# EAGLE schematic TZATZIKI_v3 (EAGLE 7.6.0)
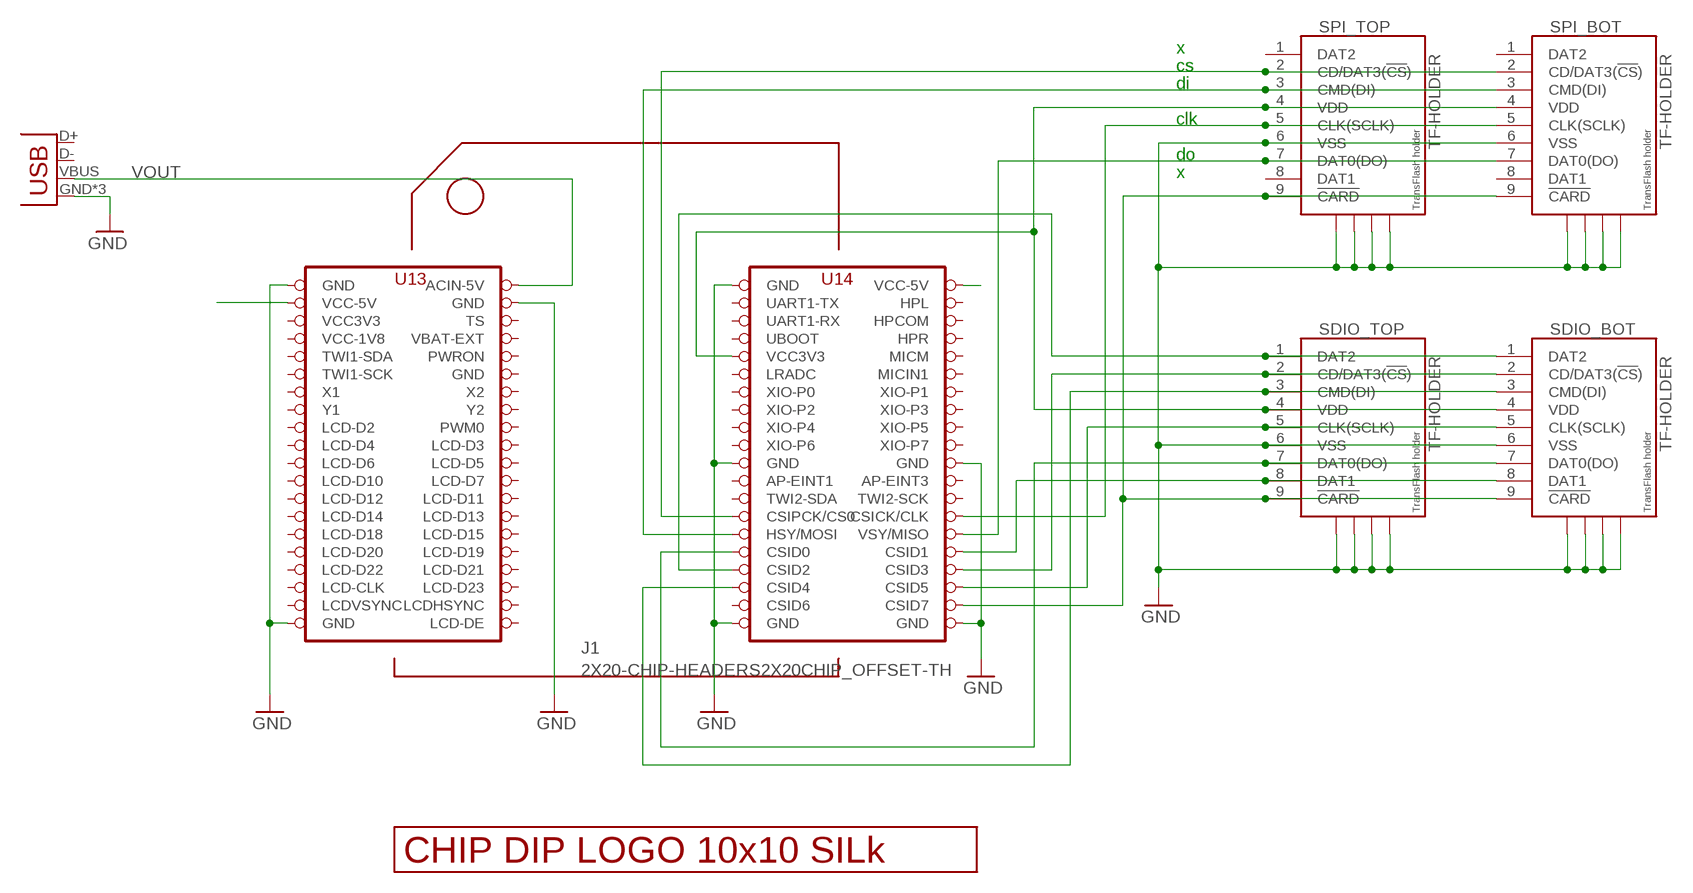
[diagram p0: schematic, sheet 1]

## Parts
J1  2X20-CHIP-HEADERS2X20CHIP_OFFSET-TH  [2X20CHIP_OFFSET-TH]
POWER_USB  USBUSB-MICROB-SMT-DIP  [USB-MICROB-SMT-DIP]
SDIO_BOT  TF-HOLDER  [TF-PULL]
SDIO_TOP  TF-HOLDER  [TF-PULL]
SPI_BOT  TF-HOLDER  [TF-PULL]
SPI_TOP  TF-HOLDER  [TF-PULL]
U$1  LOGO_10X10_SILK  [LOGO_10X10_SILK]

## Nets
GND: J1.GND@1(GND) J1.GND@2(GND) J1.GND@4(GND) J1.GND@5(GND) J1.GND@6(GND) J1.GND@7(GND) J1.GND@8(GND) J1.GND@10(GND) POWER_USB.GND POWER_USB.MT1(GND) POWER_USB.MT2(GND) SDIO_BOT.6(VSS) SDIO_BOT.S1 SDIO_BOT.S2 SDIO_BOT.S3 SDIO_BOT.S4 SDIO_TOP.6(VSS) SDIO_TOP.S1 SDIO_TOP.S2 SDIO_TOP.S3 SDIO_TOP.S4 SPI_BOT.6(VSS) SPI_BOT.S1 SPI_BOT.S2 SPI_BOT.S3 SPI_BOT.S4 SPI_TOP.6(VSS) SPI_TOP.S1 SPI_TOP.S2 SPI_TOP.S3 SPI_TOP.S4
N$2: J1.CSID3 SDIO_BOT.2(CD/DAT3(!CS!)) SDIO_TOP.2(CD/DAT3(!CS!))
N$3: J1.CSID0 SDIO_BOT.7(DAT0(DO)) SDIO_TOP.7(DAT0(DO))
N$4: J1.CSID4 SDIO_BOT.3(CMD(DI)) SDIO_TOP.3(CMD(DI))
N$5: J1.CSID5 SDIO_BOT.5(CLK(SCLK)) SDIO_TOP.5(CLK(SCLK))
N$6: J1.CSID1 SDIO_BOT.8(DAT1) SDIO_TOP.8(DAT1)
N$7: J1.VCC5V@1(VCC-5V)
N$8: J1.VCC5V@0(VCC-5V)
N$9: J1.CSID2 SDIO_BOT.1(DAT2) SDIO_TOP.1(DAT2)
N$10: J1.VCC3V3@1(VCC3V3) SDIO_BOT.4(VDD) SDIO_TOP.4(VDD) SPI_BOT.4(VDD) SPI_TOP.4(VDD)
N$11: J1.CSIPCK(CSIPCK/CS0) SPI_BOT.2(CD/DAT3(!CS!)) SPI_TOP.2(CD/DAT3(!CS!))
N$12: J1.CSIHSYNC(HSY/MOSI) SPI_BOT.3(CMD(DI)) SPI_TOP.3(CMD(DI))
N$13: J1.CSIVSYNC(VSY/MISO) SPI_BOT.7(DAT0(DO)) SPI_TOP.7(DAT0(DO))
N$14: J1.CSICK(CSICK/CLK) SPI_BOT.5(CLK(SCLK)) SPI_TOP.5(CLK(SCLK))
N$16: J1.CSID7 SDIO_BOT.9(!CARD) SDIO_TOP.9(!CARD) SPI_BOT.9(!CARD) SPI_TOP.9(!CARD)
VOUT: J1.CHG-IN(ACIN-5V) POWER_USB.VBUS
Unconnected: J1.AP-EINT1 J1.AP-EINT3 J1.BAT(VBAT-EXT) J1.CSID6 J1.FEL(UBOOT) J1.HPCOM J1.HPL J1.HPR J1.LCD-CLK J1.LCD-D2 J1.LCD-D3 J1.LCD-D4 J1.LCD-D5 J1.LCD-D6 J1.LCD-D7 J1.LCD-D10 J1.LCD-D11 J1.LCD-D12 J1.LCD-D13 J1.LCD-D14 J1.LCD-D15 J1.LCD-D18 J1.LCD-D19 J1.LCD-D20 J1.LCD-D21 J1.LCD-D22 J1.LCD-D23 J1.LCD-DE J1.LCD-HSYNC(LCDHSYNC) J1.LCD-VSYNC(LCDVSYNC) J1.LRADC J1.MICIN1 J1.MICM J1.PWM0 J1.PWRON J1.TS J1.TWI1-SCK J1.TWI1-SDA J1.TWI2-SCK J1.TWI2-SDA J1.UART1-RX J1.UART1-TX J1.X1 J1.X2 J1.XIO-P0 J1.XIO-P1 J1.XIO-P2 J1.XIO-P3 J1.XIO-P4 J1.XIO-P5 J1.XIO-P6 J1.XIO-P7 J1.Y1 J1.Y2 POWER_USB.D+ POWER_USB.D- SPI_BOT.1(DAT2) SPI_BOT.8(DAT1) SPI_TOP.1(DAT2) SPI_TOP.8(DAT1)

## Notes on the sheet
- x
- cs
- di
- clk
- do
- x

## Power pins joined to a net without a drawn wire
GND: J1.GND@3(GND)
VCC3V3: J1.VCC3V3
VCC-1V8: J1.VCC1V8(VCC-1V8)

## Library data of the parts
J1 = JKW_CHIP:2X20-CHIP-HEADERS: Through hole layout with chip reference
POWER_USB = Spark:USB
SDIO_BOT SDIO_TOP SPI_BOT SPI_TOP = JKW_CHIP:TF-HOLDER: TF / Micro SD socket is PUSH-PUSH type, the card can be pushed into and auto locked and pushed out by simply press the card. Surface Mounting type.
U$1 = JKW_CHIP:LOGO_10X10_SILK